# EAGLE design harvester_hat (EAGLE 9.0.0)
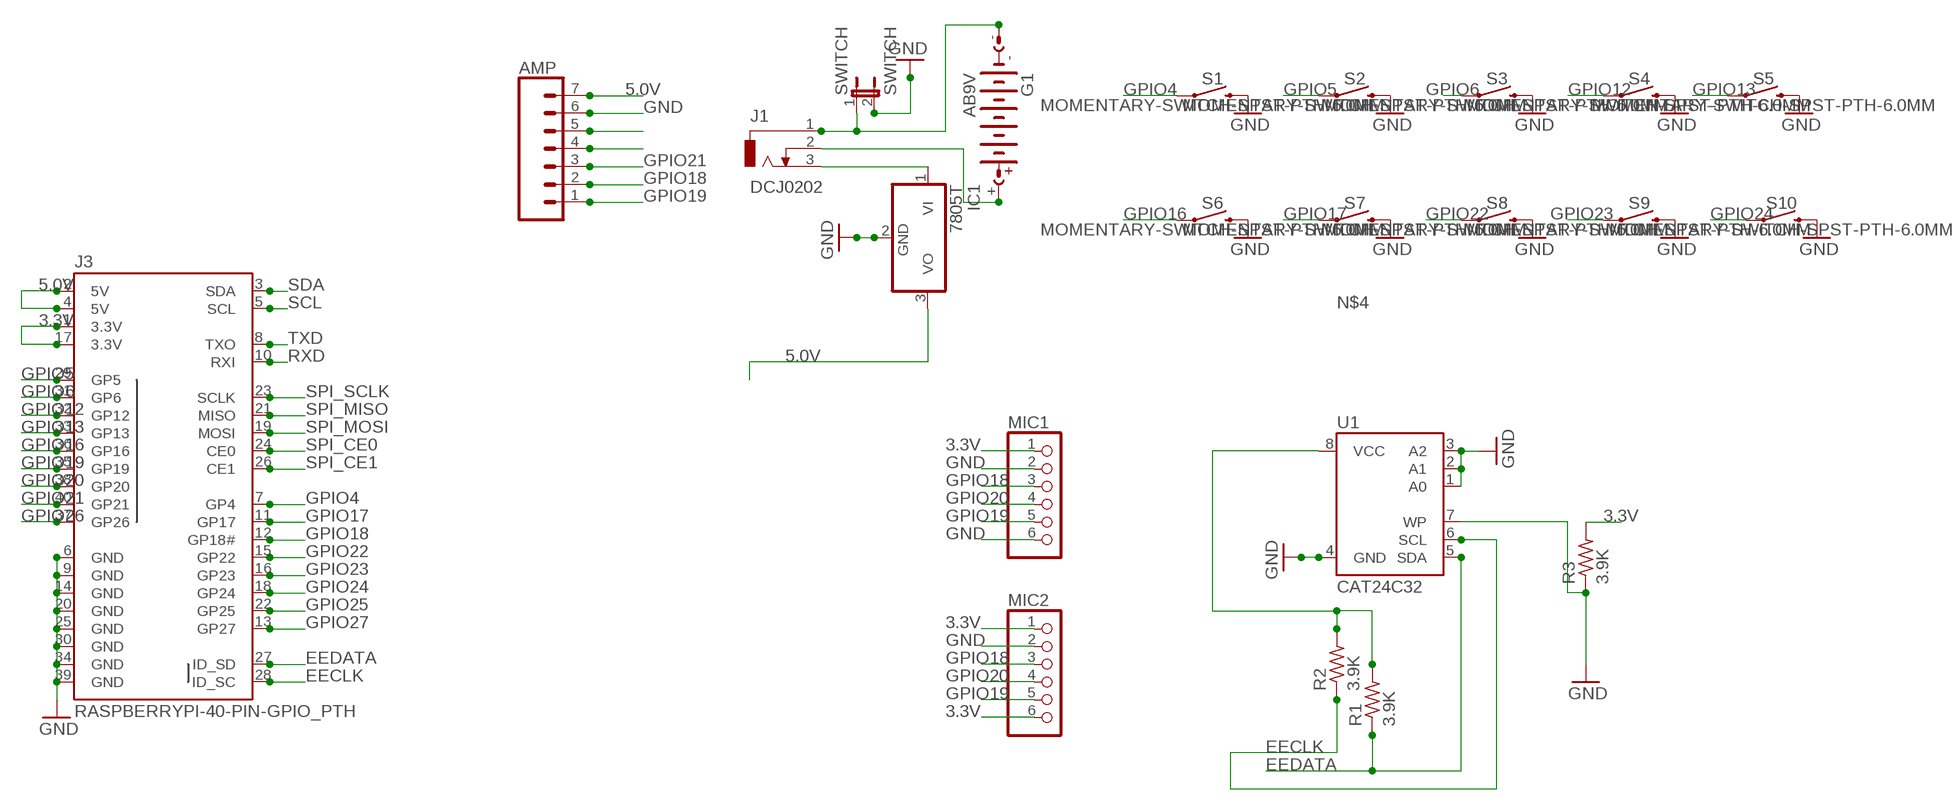
[diagram p0: schematic, sheet 1]

## Parts
AMP  CONN_07  [1X07]
G1  AB9V  [AB9V]
IC1  7805T  [TO220H]
J1  DCJ0202  [DCJ0202]
J3  RASPBERRYPI-40-PIN-GPIO_PTH  [2X20_SHROUDED]
MIC1  PINHD-1X6  [1X06]
MIC2  PINHD-1X6  [1X06]
R1  3.9K  R-US_0207/10  [0207/10]
R2  3.9K  R-US_0207/10  [0207/10]
R3  3.9K  R-US_0207/10  [0207/10]
S1  MOMENTARY-SWITCH-SPST-PTH-6.0MM  [TACTILE_SWITCH_PTH_6.0MM]
S2  MOMENTARY-SWITCH-SPST-PTH-6.0MM  [TACTILE_SWITCH_PTH_6.0MM]
S3  MOMENTARY-SWITCH-SPST-PTH-6.0MM  [TACTILE_SWITCH_PTH_6.0MM]
S4  MOMENTARY-SWITCH-SPST-PTH-6.0MM  [TACTILE_SWITCH_PTH_6.0MM]
S5  MOMENTARY-SWITCH-SPST-PTH-6.0MM  [TACTILE_SWITCH_PTH_6.0MM]
S6  MOMENTARY-SWITCH-SPST-PTH-6.0MM  [TACTILE_SWITCH_PTH_6.0MM]
S7  MOMENTARY-SWITCH-SPST-PTH-6.0MM  [TACTILE_SWITCH_PTH_6.0MM]
S8  MOMENTARY-SWITCH-SPST-PTH-6.0MM  [TACTILE_SWITCH_PTH_6.0MM]
S9  MOMENTARY-SWITCH-SPST-PTH-6.0MM  [TACTILE_SWITCH_PTH_6.0MM]
S10  MOMENTARY-SWITCH-SPST-PTH-6.0MM  [TACTILE_SWITCH_PTH_6.0MM]
SWITCH  SWITCH  JP1E  [JP1]
U1  CAT24C32  AT24CP  [DIL08]

## Nets
3.3V: J3.1(3.3V) J3.17(3.3V) MIC1.1 MIC2.1 MIC2.6 R3.2
5.0V: AMP.7 IC1.3(VO) J3.2(5V) J3.4(5V)
EECLK: J3.28(ID_SC) R2.1 U1.6(SCL)
EEDATA: J3.27(ID_SD) R1.1 U1.5(SDA)
GND: AMP.6 IC1.2(GND) J3.6(GND) J3.9(GND) J3.14(GND) J3.20(GND) J3.25(GND) J3.30(GND) J3.34(GND) J3.39(GND) MIC1.2 MIC1.6 MIC2.2 R3.1 S1.3 S2.3 S3.3 S4.3 S5.3 S6.3 S7.3 S8.3 S9.3 S10.3 SWITCH.2 U1.1(A0) U1.2(A1) U1.3(A2) U1.4(GND) U1.7(WP)
GPIO4: J3.7(GP4) S1.1
GPIO5: J3.29(GP5) S2.1
GPIO6: J3.31(GP6) S3.1
GPIO12: J3.32(GP12) S4.1
GPIO13: J3.33(GP13) S5.1
GPIO16: J3.36(GP16) S6.1
GPIO17: J3.11(GP17) S7.1
GPIO18: AMP.2 J3.12(GP18#) MIC1.3 MIC2.3
GPIO19: AMP.1 J3.35(GP19) MIC1.5 MIC2.5
GPIO20: J3.38(GP20) MIC1.4 MIC2.4
GPIO21: AMP.3 J3.40(GP21)
GPIO22: J3.15(GP22) S8.1
GPIO23: J3.16(GP23) S9.1
GPIO24: J3.18(GP24) S10.1
GPIO25: J3.22(GP25)
GPIO26: J3.37(GP26)
GPIO27: J3.13(GP27)
N$1: G1.+ J1.2
N$2: G1.- J1.1 SWITCH.1
N$3: IC1.1(VI) J1.3
N$4: R1.2 R2.2 U1.8(VCC)
N$7: AMP.5
N$8: AMP.4
RXD: J3.10(RXI)
SCL: J3.5(SCL)
SDA: J3.3(SDA)
SPI_CE0: J3.24(CE0)
SPI_CE1: J3.26(CE1)
SPI_MISO: J3.21(MISO)
SPI_MOSI: J3.19(MOSI)
SPI_SCLK: J3.23(SCLK)
TXD: J3.8(TXO)

## Library data of the parts
AMP = SparkFun-Connectors:CONN_07: Multi connection point. Often used as Generic Header-pin footprint for 0.1 inch spaced/style header connections On any of the 0.1 inch spaced packages, you can populate with these: Break Away Headers - Straight <https://www.sparkfun.com/products/116> (PRT-00116) Break Away Male Headers - Right Angle <https://www.sparkfun.com/products/553> (PRT-00553) Female Headers <https://www.sparkfun.com/products/115> (PRT-00115) Break Away Headers - Machine Pin <https://www.sparkfun.com/products/117> (PRT-00117) Break Away Female Headers - Swiss Machine Pin <https://www.sparkfun.com/products/743> (PRT-00743) For SCREWTERMINALS and SPRING TERMINALS visit here: Screw Terimnals on SparkFun.com <https://www.sparkfun.com/search/results?term=Screw+Terminals> (5mm/3.5mm/2.54mm spacing) This device is also useful as a general connection point to wire up your design to another part of your project. Our various solder wires solder well into these plated through hole pads. Hook-Up Wire - Assortment (Stranded, 22 AWG) <https://www.sparkfun.com/products/11375> (PRT-11375) Hook-Up Wire - Assortment (Solid Core, 22 AWG) <https://www.sparkfun.com/products/11367> (PRT-11367) View the entire wire category on our website here <https://www.sparkfun.com/categories/141> Special notes: Molex polarized connector foot print use with SKU : PRT-08231 with associated crimp pins and housings. 1MM SMD Version SKU: PRT-10208 NOTES ON THE VARIANTS LOCK and LOCK_LONGPADS... This footprint was designed to help hold the alignment of a through-hole component (i.e. 6-pin header) while soldering it into place. You may notice that each hole has been shifted either up or down by 0.005 of an inch from it's more standard position (which is a perfectly straight line). This slight alteration caused the pins (the squares in the middle) to touch the edges of the holes. Because they are alternating, it causes a "brace" to hold the component in place. 0.005 has proven to be the perfect amount of "off-center" position when using our standard breakaway headers. Although looks a little odd when you look at the bare footprint, once you have a header in there, the alteration is very hard to notice. Also,if you push a header all the way into place, it is covered up entirely on the bottom side.
G1 = battery:AB9V: 9-V BATTERY CLIP
IC1 = adafruit:78*: Positive VOLTAGE REGULATOR Added bigger pads to the TO-92 package
J1 = con-jack:DCJ0202: DC POWER JACK Source: DCJ0202.pdf; OC_FARNELL: unknown; OC_NEWARK: unknown
J3 = SparkFun-Connectors:RASPBERRYPI-40-PIN-GPIO: Raspberry Pi GPIO Header 2x20 pin connector, as found on B, B+, A+ models. Both shrouded PTH and SMT versions available. SparkFun Products: GPIO Shrouded Header <https://www.sparkfun.com/products/13054>- PTH SparkFun Pi Wedge (Preassembled) <https://www.sparkfun.com/products/13717>; PROD_ID: CONN-12263; SF_ID: PRT-13054
MIC1 MIC2 = adafruit:PINHD-1X6: PIN HEADER
R1-R3 = resistor:R-US_: RESISTOR, American symbol
S1-S10 = SparkFun-Switches:MOMENTARY-SWITCH-SPST: Momentary Switch (Pushbutton) - SPST Normally-open (NO) SPST momentary switches (buttons, pushbuttons). Variants PTH-12MM - 12mm square, through-hole Momentary Pushbutton Switch - 12mm Square <https://www.sparkfun.com/products/9190> (COM-09190) PTH-6.0MM, PTH-6.0MM-KIT - 6.0mm square, through-hole Mini Pushbutton Switch <https://www.sparkfun.com/products/97> (COM-00097) KIT package intended for soldering kit's - only one side of pads' copper is exposed. PTH-RIGHT-ANGLE-KIT - Right-angle, through-hole Right Angle Tactile Button <https://www.sparkfun.com/products/10791> - Used on SparkFun BigTime Watch Kit <https://www.sparkfun.com/products/11734> SMD-12MM - 12mm square, surface-mount Tactile Button - SMD (12mm) <https://www.sparkfun.com/products/12993> (COM-12993) Used on SparkFun PicoBoard <https://www.sparkfun.com/products/11888> SMD-4.5MM - 4.5mm Square Trackball Switch Used on SparkFun Blackberry Trackballer Breakout <https://www.sparkfun.com/products/13169> SMD-4.6MMX2.8MM - 4.60mm x 2.80mm, surface mount Used on SparkFun SAMD21 Mini Breakout <https://www.sparkfun.com/products/13664> SMD-5.2MM, SMD-5.2-REDUNDANT - 5.2mm square, surface-mount Mini Pushbutton Switch - SMD <https://www.sparkfun.com/products/8720> (COM-08720) Used on Arduino Pro Mini <https://www.sparkfun.com/products/11114> REDUNDANT package connects both switch circuits together SMD-6.0X3.5MM - 6.0 x 3.5mm, surface mount Momentary Reset Switch SMD <https://www.sparkfun.com/products/8229> (COM-08229) SMD-6.2MM-TALL - 6.2mm square, surface mount Tactile Button - SMD (6mm) <https://www.sparkfun.com/products/12992> Used on SparkFun Digital Sandbox <https://www.sparkfun.com/products/12651> SMD-RIGHT-ANGLE - Right-angle, surface mount Used on SparkFun Block for Intel® Edison - Arduino <https://www.sparkfun.com/products/13036>; PROD_ID: SWCH-08441; SF_SKU: COM-00097
SWITCH = jumper:JP1E: JUMPER
U1 = atmel:AT24C*: 2-wire serial EEPROM; MPN: AT24C1024BW-SH-B; OC_FARNELL: 1362646; OC_NEWARK: 03P2044

## Board
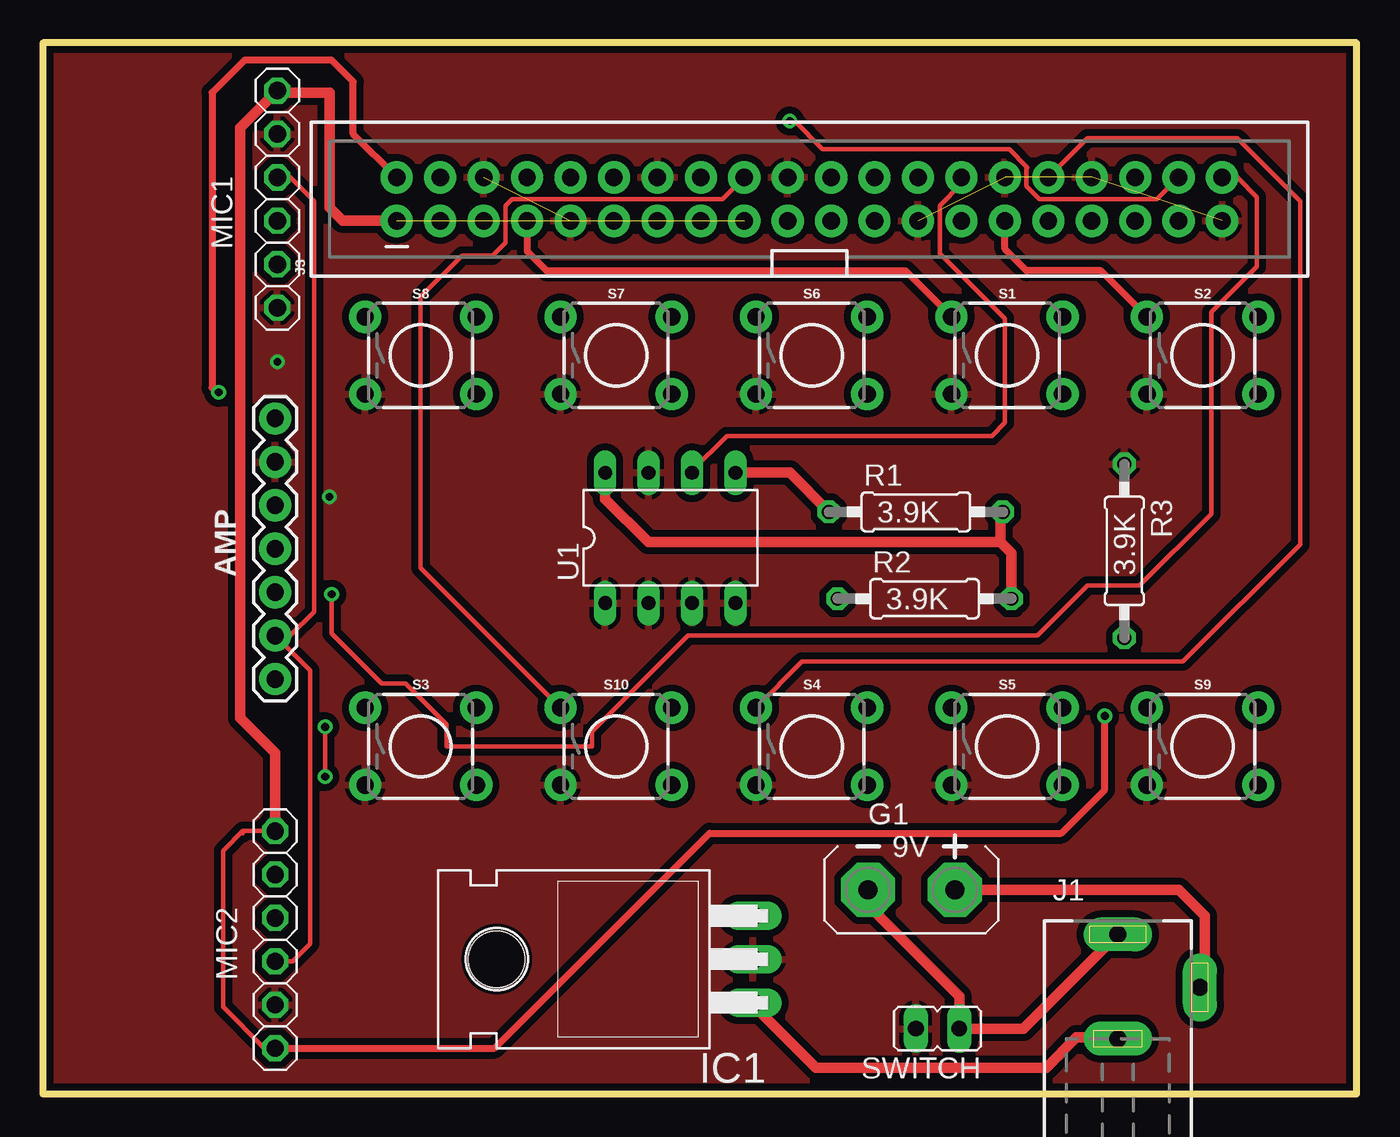
[diagram p1: board, top side]
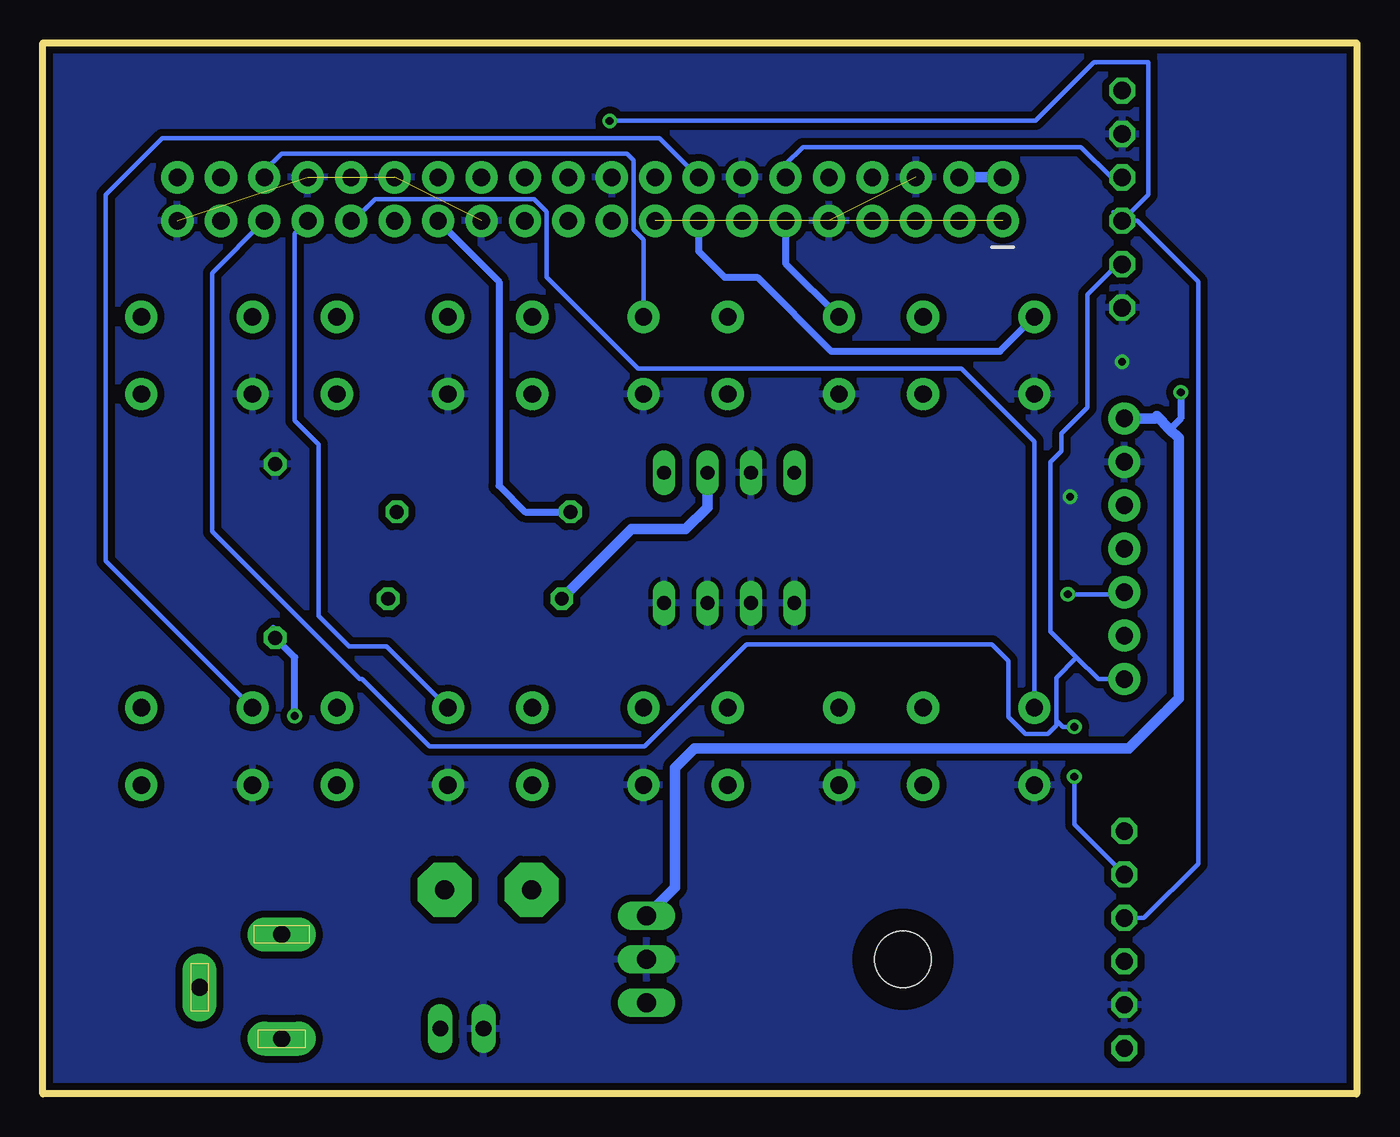
[diagram p2: board, bottom side, seen from below]

Size 76.84 x 61.47 mm. Coordinates in mm from the lower left corner, seen from the top.
Outline: 0,0 76.84,0 76.84,61.47 0,61.47 0,0
Copper layers (1*16): Top 0.035mm / dielectric 1.5mm / Bottom 0.035mm
Design rules "adafruit *": minimum track width 8mil, minimum drill 15.5mil, track to track 8mil, track to pad 8mil, pad to pad 8mil, via to via 8mil, smd to smd 8mil, copper to edge 10mil, drill to drill 8mil, minimum pad ring 10mil, minimum via ring 8mil, stop-mask expansion 2mil, vias tented up to drill 20mil, thermal gap 10mil

### Footprints (pad centres in the part's own frame; a part is rotated, then mirrored left to right if it is on the bottom)
1X07 = drill 1.016 pad 1.88: 1 0,0; 2 2.54,0; 3 5.08,0; 4 7.62,0; 5 10.16,0; 6 12.7,0; 7 15.24,0
AB9V = drill 1.118 pad 3.15 octagon: + 0,2.54; - 0,-2.54
TO220H = drill 1.118 long: 1 -2.54,-10.16; 2 0,-10.16; 3 2.54,-10.16 | hole 3.302: 0,4.826
DCJ0202 = drill 1 pad 2 long: 1 0,3.1; 2 4.8,0; 3 0,-3
2X20_SHROUDED = drill 1.016 pad 1.88: 1 -1.27,24.13; 2 1.27,24.13; 3 -1.27,21.59; 4 1.27,21.59; 5 -1.27,19.05; 6 1.27,19.05; 7 -1.27,16.51; 8 1.27,16.51; 9 -1.27,13.97; 10 1.27,13.97; 11 -1.27,11.43; 12 1.27,11.43; 13 -1.27,8.89; 14 1.27,8.89; 15 -1.27,6.35; 16 1.27,6.35; 17 -1.27,3.81; 18 1.27,3.81; 19 -1.27,1.27; 20 1.27,1.27; 21 -1.27,-1.27; 22 1.27,-1.27; 23 -1.27,-3.81; 24 1.27,-3.81; 25 -1.27,-6.35; 26 1.27,-6.35; 27 -1.27,-8.89; 28 1.27,-8.89; 29 -1.27,-11.43; 30 1.27,-11.43; 31 -1.27,-13.97; 32 1.27,-13.97; 33 -1.27,-16.51; 34 1.27,-16.51; 35 -1.27,-19.05; 36 1.27,-19.05; 37 -1.27,-21.59; 38 1.27,-21.59; 39 -1.27,-24.13; 40 1.27,-24.13
1X06 = drill 1.016 octagon: 1 -6.35,0; 2 -3.81,0; 3 -1.27,0; 4 1.27,0; 5 3.81,0; 6 6.35,0
0207/10 = drill 0.813 octagon: 1 -5.08,0; 2 5.08,0
TACTILE_SWITCH_PTH_6.0MM = drill 1.016 pad 1.88: 1 -3.251,2.261; 2 3.251,2.261; 3 -3.251,-2.261; 4 3.251,-2.261
JP1 = drill 0.914 long: 1 0,-1.27; 2 0,1.27
DIL08 = drill 0.813 long: 1 -3.81,-3.81; 2 -1.27,-3.81; 3 1.27,-3.81; 4 3.81,-3.81; 5 3.81,3.81; 6 1.27,3.81; 7 -1.27,3.81; 8 -3.81,3.81

### Placement (x,y rotation side)
AMP  13.59,24.26 90 top
G1  50.8,11.94 270 top
IC1  31.37,7.87 90 top
J1  62.87,6.22 0 top
J3  44.83,52.32 90 top
MIC1  13.72,52.32 270 top
MIC2  13.59,9.02 90 top
R1  51.05,34.04 0 top
R2  51.56,28.96 0 top
R3  63.25,31.75 270 top
S1  56.39,43.18 0 top
S2  67.82,43.18 0 top
S3  22.1,20.32 0 top
S4  44.96,20.32 0 top
S5  56.39,20.32 0 top
S6  44.96,43.18 0 top
S7  33.53,43.18 0 top
S8  22.1,43.18 0 top
S9  67.82,20.32 0 top
S10  33.53,20.32 0 top
SWITCH  52.32,3.81 90 top
U1  36.7,32.51 0 top

### Tracks (layer width: path | path; a pad name or v marks a point on that pad's centre or on a via)
3.3V  (via drill 0.45)  (1 unrouted)
  Top 0.254: MIC2.1 12.95,2.67 10.54,5.08 10.54,14.22 11.68,15.37 | 11.68,15.24 11.68,15.37 | 11.68,15.37 MIC2.6
  Top 0.406: MIC2.1 26.42,2.67 38.99,15.24 59.56,15.24 62.1,17.78 v62.1,22.1
  Top 0.61: MIC2.6 13.59,19.94 11.56,21.97 11.56,56.52 MIC1.1 13.84,58.55 16.76,58.55 16.76,51.82 17.53,51.05 J3.1
  Bottom 0.254: 63.37,27.3 63.25,27.18 R3.2
  Bottom 0.406: v62.1,22.1 62.1,25.53 R3.2
5.0V  (via drill 0.45)
  Top 0.406: J3.2 18.16,56.13 18.16,59.18 16.89,60.45 11.81,60.45 9.91,58.55 9.91,41.27 10.29,40.89 v10.29,41.02
  Bottom 0.406: v10.29,41.02 10.29,39.5 10.92,38.86
  Bottom 0.61: 20.19,53.98 20.32,53.98 J3.2 J3.4 | AMP.7 11.81,39.5 11.68,39.62 10.92,38.86 10.41,38.35 10.41,23.11 13.34,20.19 38.73,20.19 39.88,19.05 39.88,12.06 IC1.3
EECLK
  Top 0.254: J3.28 53.72,53.21 52.45,51.94 52.45,49.15 56.26,45.34 56.26,39.24 55.5,38.48 40.01,38.48 37.97,36.45 U1.6
  Bottom 0.61: R2.1 42.42,33.02 39.24,33.02 37.97,34.29 U1.6
EEDATA
  Top 0.61: R1.1 43.69,36.32 U1.5
  Bottom 0.406: J3.27 50.16,47.5 50.16,35.56 48.64,34.04 R1.1
GND  (via drill 0.45)  (4 unrouted)
  Top 0.254: 13.84,4.7 13.84,4.95 MIC2.2 13.59,4.95 13.84,4.7 | 13.84,4.57 13.84,4.7
  other vias: 13.72,42.8 16.76,34.92
  pour Top (isolate 0.406): 0.25,0 0.25,61.34 0.38,61.47 76.84,61.47 77.09,61.72 77.09,0.25 77.34,0 0.51,0 0.38,-0.13
  pour Bottom (isolate 0.406): 0.38,0 0.38,61.34 0.25,61.47 76.84,61.47 77.09,61.72 77.09,0.13 77.34,-0.13 0.38,-0.13
GPIO4
  Top 0.406: J3.7 28.32,49.28 29.46,48.13 50.44,48.13 S1.1
GPIO5
  Top 0.406: S2.1 61.87,48.13 57.53,48.13 56.26,49.4 J3.29
GPIO6
  Bottom 0.254: S3.1 18.85,38.15 23.11,42.42 42.04,42.42 47.37,47.75 47.37,51.58 48.12,52.32 57.4,52.32 58.67,51.05 J3.31
GPIO12
  Top 0.254: S4.1 44.4,25.27 66.67,25.27 73.53,32.13 73.53,52.2 69.85,55.88 61.09,55.88 J3.32
GPIO13
  Top 0.254: 52.58,22.73 52.73,22.58 S5.1
  Bottom 0.254: 61.85,51.31 61.59,51.05 J3.33 62.1,50.29 62.1,39.37 60.71,37.97 60.71,27.94 58.93,26.16 56.72,26.16 S5.1
GPIO16
  Bottom 0.254: S6.1 41.71,49.94 42.29,50.53 42.29,54.61 42.67,54.99 62.87,54.99 63.88,53.98 J3.36
GPIO17
  Bottom 0.406: J3.11 33.4,48.56 S7.1
GPIO18
  Top 0.254: MIC1.3 14.48,53.59 15.88,52.2 15.88,28.19 14.48,26.8 AMP.2 15.62,24.77 15.62,8.76 14.61,7.75 MIC2.3
  Bottom 0.254: J3.12 33.4,54.36 32.38,55.37 16.13,55.37 14.35,53.59 MIC1.3
GPIO19  (via drill 0.45)
  Top 0.254: AMP.1 13.97,23.88 14.1,23.88 | v16.51,18.54 v16.51,21.46
  Bottom 0.254: 14.22,24.26 AMP.1 15.11,24.26 16.38,25.53 | 16.38,25.53 17.91,27.05 17.91,36.96 17.27,37.59 17.27,38.61 15.75,40.13 15.75,46.74 13.97,48.51 MIC1.5 | J3.35 66.93,48.01 66.93,32.89 58.29,24.26 58.17,24.26 54.23,20.32 41.66,20.32 35.69,26.29 21.34,26.29 20.37,25.32 20.37,22.05 19.37,21.06 18.07,21.06 17.58,21.55 17.58,21.84 | 16.38,25.53 17.58,24.33 17.58,21.84 | MIC2.5 16.51,15.75 v16.51,18.54 | v16.51,21.46 17.2,21.46 17.58,21.84
GPIO20  (via drill 0.45)
  Top 0.254: MIC2.4 14.1,10.29 14.22,10.16 | J3.38 65.15,52.32 58.28,52.32 57.53,53.07 57.53,54.12 57.59,54.17 56.52,55.24 45.59,55.24 43.94,56.9 v43.69,56.9
  Bottom 0.254: MIC1.4 14.22,51.56 | 13.21,9.91 MIC2.4 12.45,10.29 9.27,13.46 9.27,47.5 12.83,51.05 MIC1.4 | v43.69,56.9 18.8,56.9 15.37,60.33 12.19,60.33 12.19,52.58 MIC1.4
GPIO21  (via drill 0.45)
  Top 0.254: J3.40 69.85,53.59 70.99,52.45 70.99,48.39 68.33,45.72 68.33,33.91 64.14,29.72 61.09,29.72 58.17,26.8 37.72,26.8 32.13,21.21 32.13,20.32 23.62,20.32 23.62,21.59 21.21,24 19.81,24 16.89,26.92 v16.89,29.21
  Bottom 0.254: v16.89,29.21 13.72,29.21 AMP.3
GPIO22
  Bottom 0.406: J3.15 38.48,49.28 36.96,47.75 35.05,47.75 30.73,43.43 20.85,43.43 S8.1
GPIO23
  Bottom 0.254: S9.1 73.15,31.17 73.15,52.58 69.85,55.88 40.77,55.88 J3.16
GPIO24
  Top 0.254: S10.1 22.1,30.76 22.1,46.61 24.51,49.02 26.29,49.02 27.05,49.78 27.05,51.94 27.43,52.32 39.75,52.32 J3.18
N$1
  Top 0.61: G1.+ 66.42,11.94 67.94,10.41 67.94,6.5 J1.2
N$2
  Top 0.61: G1.- 48.26,11.05 53.59,5.71 SWITCH.1 57.35,3.81 J1.1
N$3
  Top 0.61: IC1.1 41.53,5.21 45.21,1.52 58.67,1.52 60.45,3.3 62.79,3.3 J1.3
N$4
  Top 0.61: U1.8 32.89,34.8 35.43,32.26 56.01,32.26 | 56.01,32.26 56.01,33.91 R1.2 | R2.2 56.64,31.62 56.01,32.26
  Bottom 0.254: U1.8 33.02,36.45 33.4,36.45
SCL
  Bottom 0.406: 26.54,51.05 J3.5

### Text on the board
tSilk: + | + | + | +